# EAGLE design hdmilight-Duo (EAGLE 7.5.0)
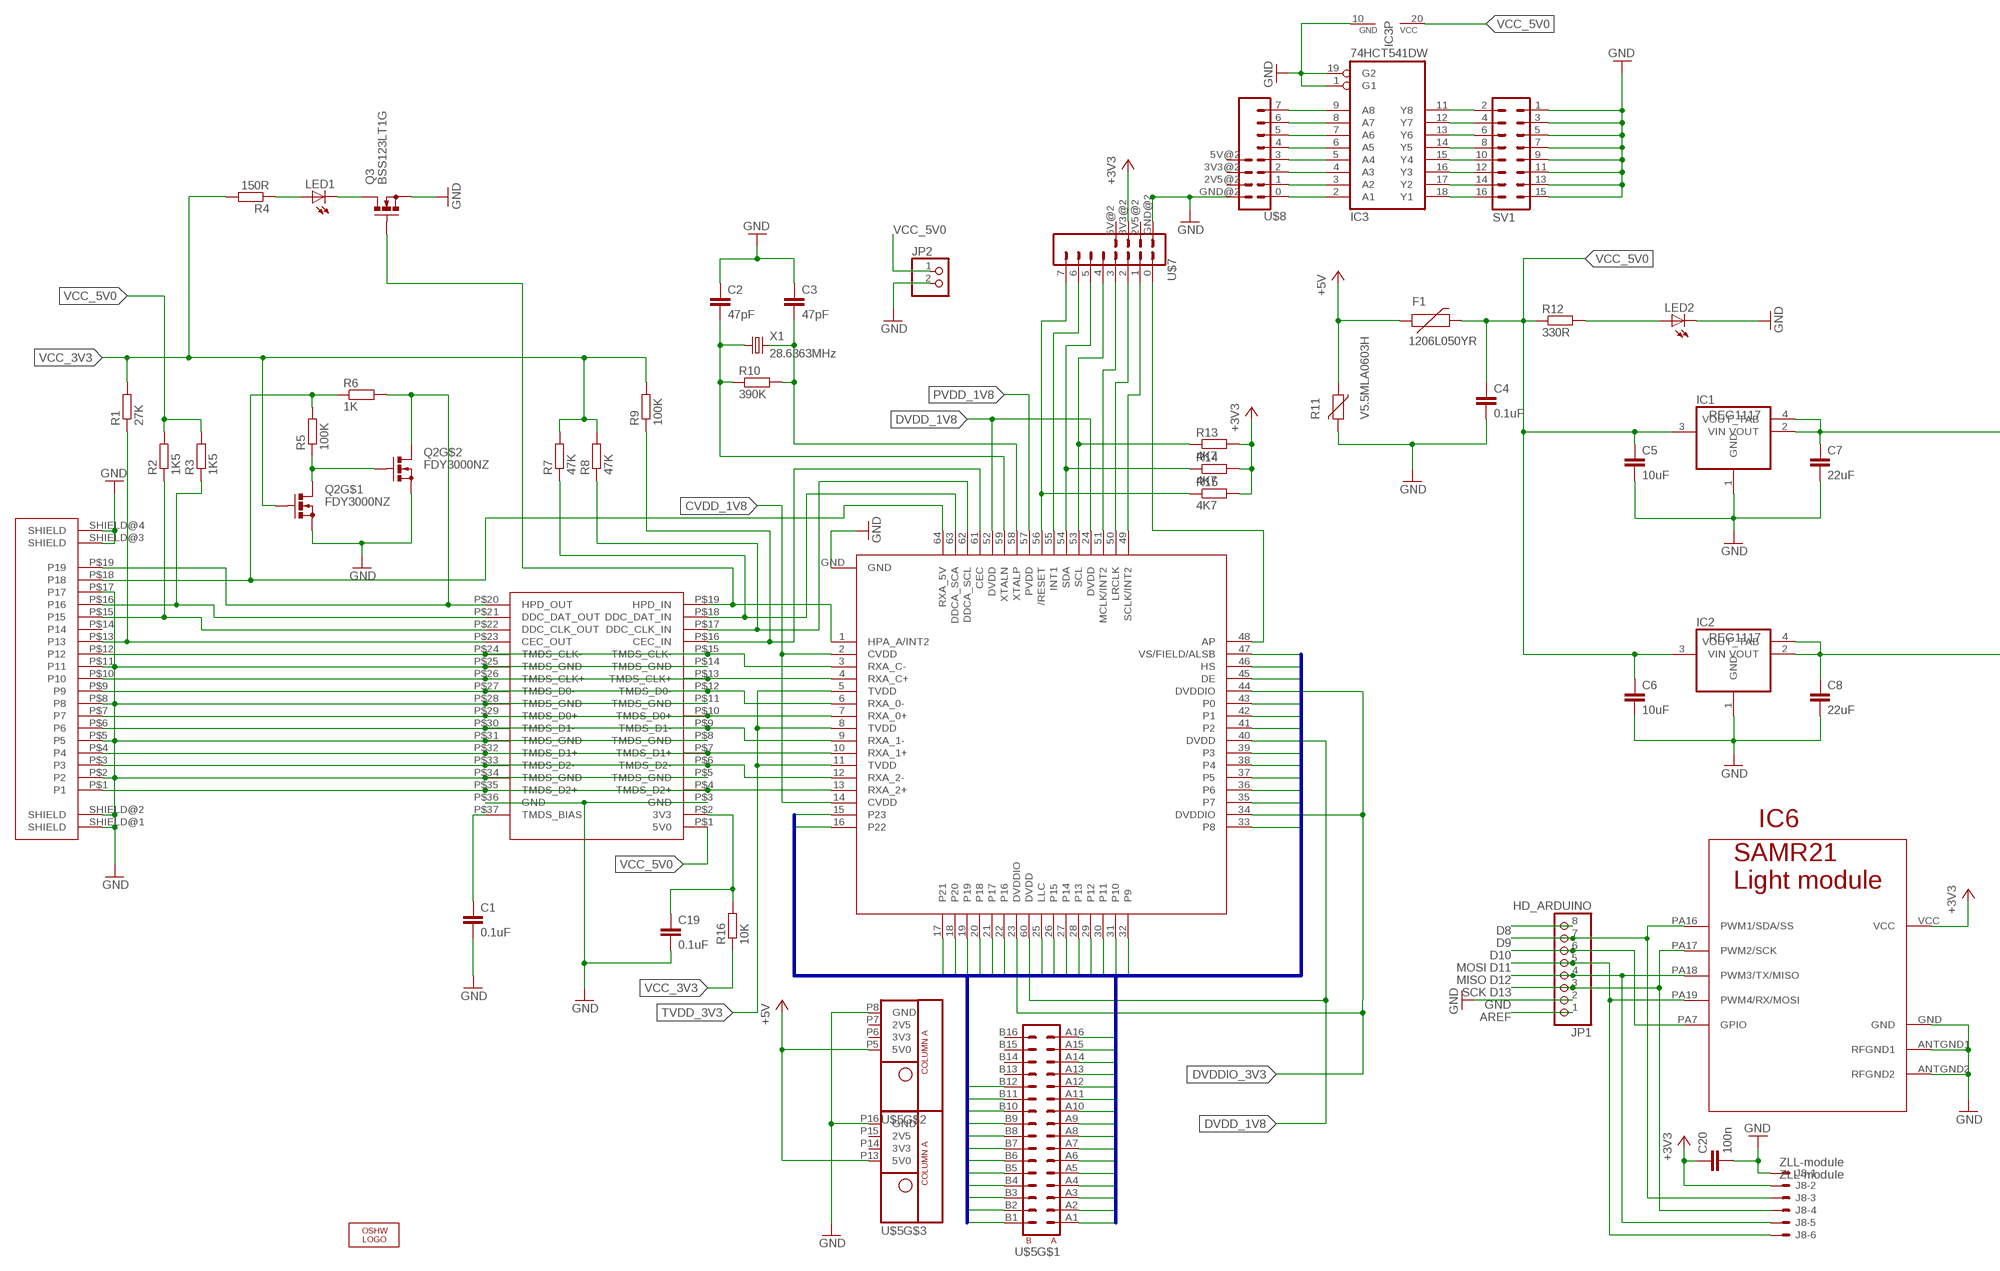
[diagram p0: schematic, sheet 1, part 1 of 2]
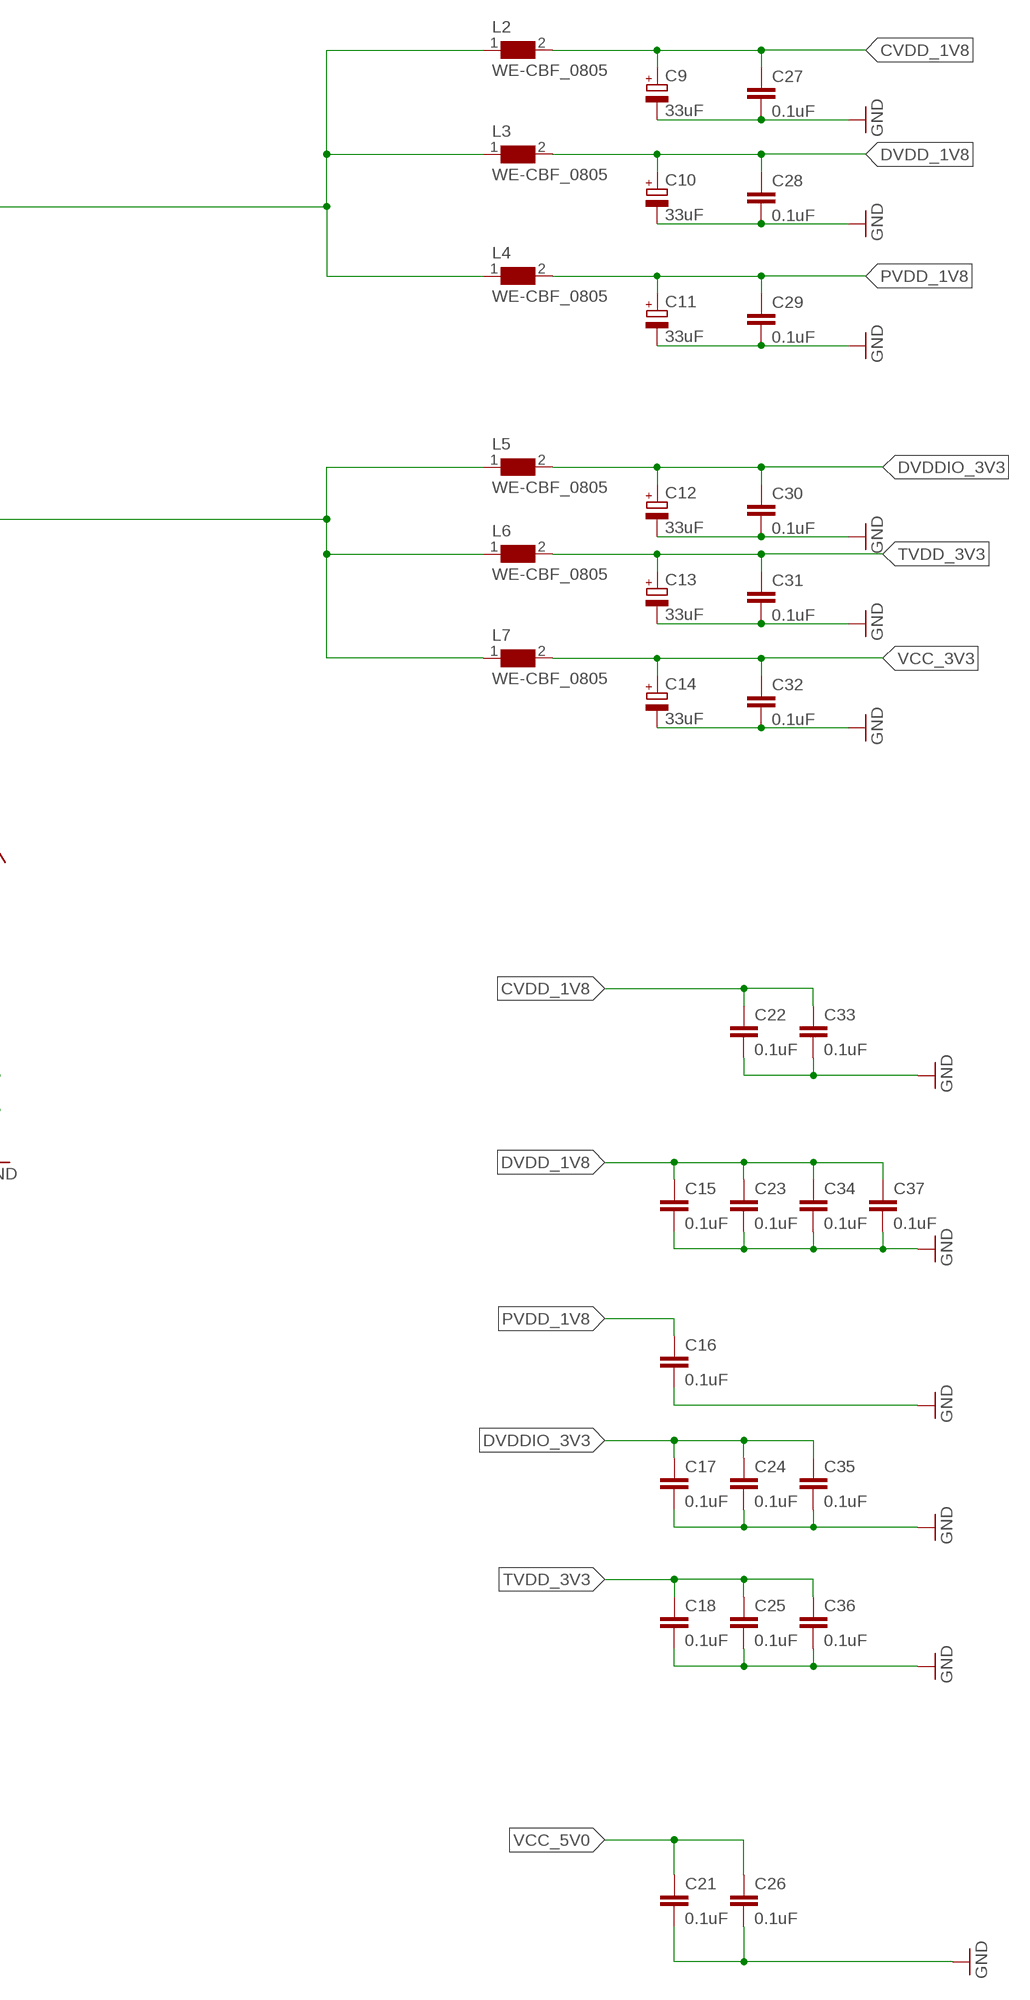
[diagram p1: schematic, sheet 1, part 2 of 2]

## Parts
C1  0.1uF  C-EUC0603  [C0603]
C2  47pF  C-EUC0603  [C0603]
C3  47pF  C-EUC0603  [C0603]
C4  0.1uF  C-EUC0603  [C0603]
C5  10uF  C-EUC1210  [C1210]
C6  10uF  C-EUC1210  [C1210]
C7  22uF  C-EUC1206  [C1206]
C8  22uF  C-EUC1206  [C1206]
C9  33uF  CPOL-EUSMCB  [SMC_B]
C10  33uF  CPOL-EUSMCB  [SMC_B]
C11  33uF  CPOL-EUSMCB  [SMC_B]
C12  33uF  CPOL-EUSMCB  [SMC_B]
C13  33uF  CPOL-EUSMCB  [SMC_B]
C14  33uF  CPOL-EUSMCB  [SMC_B]
C15  0.1uF  C-EUC0402  [C0402]
C16  0.1uF  C-EUC0603  [C0603]
C17  0.1uF  C-EUC0603  [C0603]
C18  0.1uF  C-EUC0402  [C0402]
C19  0.1uF  C-EUC0603  [C0603]
C20  100n  C-EUC0603K  [C0603K]
C21  0.1uF  C-EUC0603  [C0603]
C22  0.1uF  C-EUC0603  [C0603]
C23  0.1uF  C-EUC0402  [C0402]
C24  0.1uF  C-EUC0603  [C0603]
C25  0.1uF  C-EUC0402  [C0402]
C26  0.1uF  C-EUC0603  [C0603]
C27  0.1uF  C-EUC0603  [C0603]
C28  0.1uF  C-EUC0603  [C0603]
C29  0.1uF  C-EUC0603  [C0603]
C30  0.1uF  C-EUC0603  [C0603]
C31  0.1uF  C-EUC0603  [C0603]
C32  0.1uF  C-EUC0603  [C0603]
C33  0.1uF  C-EUC0603  [C0603]
C34  0.1uF  C-EUC0402  [C0402]
C35  0.1uF  C-EUC0402  [C0402]
C36  0.1uF  C-EUC0402  [C0402]
C37  0.1uF  C-EUC0402  [C0402]
F1  1206L050YR  PTCSMD  [PTC-1206]
IC1  REG1117  [SOT223]
IC2  REG1117  [SOT223]
IC3  74HCT541DW  [SO20W]
IC4  ADV7611  [TQFP64-10X10]
IC5  TPD12S520  IP4776CZ38  [TSSOP38]
IC6  SAMR21-MODLL  [SAMR21-LLMOD]
J1  FCI_HDMI_SOCKET_10029449-001RCF  [FCI_HDMI_SOCKET_10029449-001RCF]
J8  ZLL-module  331-06  [331-06]
JP1  HD_ARDUINO  PINHD-1X8/OCT  [1X08/OCT]
JP2  PINHD-1X2/OCT  [1X02/OCT]
L2  WE-CBF_0805  [0805]
L3  WE-CBF_0805  [0805]
L4  WE-CBF_0805  [0805]
L5  WE-CBF_0805  [0805]
L6  WE-CBF_0805  [0805]
L7  WE-CBF_0805  [0805]
LED1  LEDCHIP-LED0805  [CHIP-LED0805]
LED2  LEDCHIP-LED0805  [CHIP-LED0805]
LOGO1  OSHW_LOGO_FILLX0200-NT  [OSHW_FILLX200_NOTEXT]
Q2  FDY3000NZ  [SC89-6]
Q3  BSS123LT1G  [SOT23]
R1  27K  R-EU_R0603  [R0603]
R2  1K5  R-EU_R0603  [R0603]
R3  1K5  R-EU_R0603  [R0603]
R4  150R  R-EU_R0603  [R0603]
R5  100K  R-EU_R0603  [R0603]
R6  1K  R-EU_R0603  [R0603]
R7  47K  R-EU_R0603  [R0603]
R8  47K  R-EU_R0603  [R0603]
R9  100K  R-EU_R0603  [R0603]
R10  390K  R-EU_R0603  [R0603]
R11  V5.5MLA0603H  VARISTORCN0603  [CT/CN0603]
R12  330R  R-EU_R0603  [R0603]
R13  4K7  R-EU_R0603  [R0603]
R14  4K7  R-EU_R0603  [R0603]
R15  4K7  R-EU_R0603  [R0603]
R16  10K  R-EU_R0603  [R0603]
SV1  MA08-2  [MA08-2]
U$5  WING32_HALF  [WING32_HALF_NOHOLES]
U$7  WING8WING8_NOHOLES  [WINGSIDE_8BIT_NOHOLES]
U$8  WING8WING8_NOHOLES  [WINGSIDE_8BIT_NOHOLES]
X1  28.6363MHz  CRYSTALSM49  [SM49]

## Nets
+3V3: C20.1 IC6.VCC J8.3 R13.2 R14.2 R15.2 U$7.3V3@2(3V3)
+5V: F1.1 R11.1 U$5.P5(5V0) U$5.P13(5V0)
AP: IC4.48(AP) U$7.0
AREF: JP1.1
CVDD_1V8: C9.+ C22.1 C27.1 C33.1 IC4.2(CVDD) IC4.14(CVDD) L2.2
D8: JP1.8
D9: IC6.PA16(PWM1/SDA/SS) J8.5 JP1.7
D10: IC6.PA7(GPIO) JP1.6
D11: IC6.PA19(PWM4/RX/MOSI) J8.11 JP1.5
D12: IC6.PA18(PWM3/TX/MISO) J8.9 JP1.4
D13: IC6.PA17(PWM2/SCK) J8.7 JP1.3
DE: IC4.45(DE) U$5.B2
DVDD_1V8: C10.+ C15.1 C23.1 C28.1 C34.1 C37.1 IC4.24(DVDD) IC4.40(DVDD) IC4.52(DVDD) IC4.60(DVDD) L3.2
DVDDIO_3V3: C12.+ C17.1 C24.1 C30.1 C35.1 IC4.23(DVDDIO) IC4.34(DVDDIO) IC4.44(DVDDIO) L5.2
GND: C1.2 C2.1 C3.1 C4.2 C5.2 C6.2 C7.2 C8.2 C9.- C10.- C11.- C12.- C13.- C14.- C15.2 C16.2 C17.2 C18.2 C19.2 C20.2 C21.2 C22.2 C23.2 C24.2 C25.2 C26.2 C27.2 C28.2 C29.2 C30.2 C31.2 C32.2 C33.2 C34.2 C35.2 C36.2 C37.2 IC1.1(GND) IC2.1(GND) IC3.1(G1) IC3.10(GND) IC3.19(G2) IC4.GND IC5.P$3(GND) IC5.P$5(TMDS_GND) IC5.P$8(TMDS_GND) IC5.P$11(TMDS_GND) IC5.P$14(TMDS_GND) IC5.P$25(TMDS_GND) IC5.P$28(TMDS_GND) IC5.P$31(TMDS_GND) IC5.P$34(TMDS_GND) IC5.P$36(GND) IC6.ANTGND1(RFGND1) IC6.ANTGND2(RFGND2) IC6.GND J1.P$2(P2) J1.P$5(P5) J1.P$8(P8) J1.P$11(P11) J1.P$17(P17) J1.SHIELD@1(SHIELD) J1.SHIELD@2(SHIELD) J1.SHIELD@3(SHIELD) J1.SHIELD@4(SHIELD) J8.1 JP1.2 JP2.2 LED2.C Q2.P$1(S) Q2.P$4(S) Q3.2(S) R11.2 SV1.1 SV1.3 SV1.5 SV1.7 SV1.9 SV1.11 SV1.13 SV1.15 U$5.P8(GND) U$5.P16(GND) U$7.GND@2(GND) U$8.GND@2(GND)
HS: IC4.46(HS) U$5.A1
INT1: IC4.55(INT1) U$7.6
LLC: IC4.25(LLC) U$5.A14
LRCLK: IC4.50(LRCLK) U$7.2
MCLK: IC4.51(MCLK/INT2) U$7.3
N$1: IC4.13(RXA_2+) IC5.P$4(TMDS_D2+) IC5.P$35(TMDS_D2+) J1.P$1(P1)
N$2: IC4.12(RXA_2-) IC5.P$6(TMDS_D2-) IC5.P$33(TMDS_D2-) J1.P$3(P3)
N$3: IC4.10(RXA_1+) IC5.P$7(TMDS_D1+) IC5.P$32(TMDS_D1+) J1.P$4(P4)
N$4: IC4.9(RXA_1-) IC5.P$9(TMDS_D1-) IC5.P$30(TMDS_D1-) J1.P$6(P6)
N$5: IC4.7(RXA_0+) IC5.P$10(TMDS_D0+) IC5.P$29(TMDS_D0+) J1.P$7(P7)
N$6: IC4.6(RXA_0-) IC5.P$12(TMDS_D0-) IC5.P$27(TMDS_D0-) J1.P$9(P9)
N$7: IC4.4(RXA_C+) IC5.P$13(TMDS_CLK+) IC5.P$26(TMDS_CLK+) J1.P$10(P10)
N$8: IC4.3(RXA_C-) IC5.P$15(TMDS_CLK-) IC5.P$24(TMDS_CLK-) J1.P$12(P12)
N$9: IC3.9(A8) U$8.7
N$10: IC3.8(A7) U$8.6
N$11: IC3.7(A6) U$8.5
N$12: IC3.6(A5) U$8.4
N$13: IC5.P$23(CEC_OUT) J1.P$13(P13) R1.1
N$14: IC5.P$22(DDC_CLK_OUT) J1.P$15(P15) R2.1
N$15: IC5.P$21(DDC_DAT_OUT) J1.P$16(P16) R3.1
N$16: IC5.P$20(HPD_OUT) J1.P$19(P19) Q2.P$3(D) R6.2
N$17: IC3.5(A4) U$8.3
N$18: IC3.4(A3) U$8.2
N$19: LED2.A R12.2
N$20: IC4.62(DDCA_SCL) IC5.P$17(DDC_CLK_IN) R8.1
N$21: C8.1 IC2.2(VOUT) IC2.4(VOUT_TAB) L5.1 L6.1 L7.1
N$22: C7.1 IC1.2(VOUT) IC1.4(VOUT_TAB) L2.1 L3.1 L4.1
N$23: IC4.63(DDCA_SCA) IC5.P$18(DDC_DAT_IN) R7.1
N$24: IC4.61(CEC) IC5.P$16(CEC_IN) R9.1
N$25: C2.2 IC4.59(XTALN) R10.1 X1.1
N$26: C3.2 IC4.58(XTALP) R10.2 X1.2
N$34: C1.1 IC5.P$37(TMDS_BIAS)
N$35: IC3.3(A2) U$8.1
N$36: IC3.2(A1) U$8.0
N$37: IC3.11(Y8) SV1.2
N$39: IC3.12(Y7) SV1.4
N$40: IC3.13(Y6) SV1.6
N$41: IC3.15(Y4) SV1.10
N$42: IC3.16(Y3) SV1.12
N$44: IC3.17(Y2) SV1.14
N$45: IC3.18(Y1) SV1.16
N$46: IC3.14(Y5) SV1.8
N$47: C19.1 IC5.P$2(3V3) R16.2
N$52: Q2.P$5(G) Q2.P$6(D) R5.1
N$53: IC4.64(RXA_5V) J1.P$18(P18) R5.2 R6.1
N$55: LED1.A R4.1
N$56: LED1.C Q3.3(D)
N$57: IC4.1(HPA_A/INT2) IC5.P$19(HPD_IN) Q3.1(G)
NRESET: IC4.56(/RESET) R15.1 U$7.7
P0: IC4.43(P0) U$5.A2
P1: IC4.42(P1) U$5.B3
P2: IC4.41(P2) U$5.A3
P3: IC4.39(P3) U$5.B4
P4: IC4.38(P4) U$5.A4
P5: IC4.37(P5) U$5.B5
P6: IC4.36(P6) U$5.A5
P7: IC4.35(P7) U$5.B6
P8: IC4.33(P8) U$5.A6
P9: IC4.32(P9) U$5.B7
P10: IC4.31(P10) U$5.A7
P11: IC4.30(P11) U$5.B8
P12: IC4.29(P12) U$5.A8
P13: IC4.28(P13) U$5.B9
P14: IC4.27(P14) U$5.A9
P15: IC4.26(P15) U$5.B10
P16: IC4.22(P16) U$5.A10
P17: IC4.21(P17) U$5.B11
P18: IC4.20(P18) U$5.A11
P19: IC4.19 U$5.B12
P20: IC4.18(P20) U$5.A12
P21: IC4.17(P21) U$5.A13
P22: IC4.16(P22) U$5.A15
P23: IC4.15(P23) U$5.A16
PVDD_1V8: C11.+ C16.1 C29.1 IC4.57(PVDD) L4.2
SCL: IC4.53(SCL) R13.1 U$7.4
SCLK: IC4.49(SCLK/INT2) U$7.1
SDA: IC4.54(SDA) R14.1 U$7.5
TVDD_3V3: C13.+ C18.1 C25.1 C31.1 C36.1 IC4.5(TVDD) IC4.8(TVDD) IC4.11(TVDD) L6.2
VCC_3V3: C14.+ C32.1 L7.2 Q2.P$2(G) R1.2 R4.2 R7.2 R8.2 R9.2 R16.1
VCC_5V0: C4.1 C5.1 C6.1 C21.1 C26.1 F1.2 IC1.3(VIN) IC2.3(VIN) IC3.20(VCC) IC5.P$1(5V0) JP2.1 R2.2 R3.2 R12.1
VS: IC4.47(VS/FIELD/ALSB) U$5.B1
Unconnected: J1.P$14(P14) U$5.B13 U$5.B14 U$5.B15 U$5.B16 U$5.P6(3V3) U$5.P7(2V5) U$5.P14(3V3) U$5.P15(2V5) U$7.2V5@2(2V5) U$7.5V@2(5V) U$8.2V5@2(2V5) U$8.3V3@2(3V3) U$8.5V@2(5V)

## Buses
P[0..23],LLC,DE,HS,VS

## Notes on the sheet
- MOSI
- MISO
- SCK

## Library data of the parts
C1-C8 C15-C19 C21-C37 = resistor:C-EU: CAPACITOR, European symbol
C9-C14 = resistor:CPOL-EU: POLARIZED CAPACITOR, European symbol
C20 = rcl:C-EU: CAPACITOR, European symbol
F1 = SparkFun:PTC: Resettable Fuse PTC Resettable Fuse. Spark Fun Electronics SKU : COM-08357
IC1 IC2 = burr-brown:REG1117: 800mA and 1A Low Dropout (LDO) Positive Regulator 1.8V, 2.5V, 2.85V, 3.3V, 5V, and Adj; MPN: REG1117; OC_FARNELL: 1097566; OC_NEWARK: 14P6981
IC3 = 74xx-eu:74*541: Octal BUFFER and LINE DRIVER, 3-state
IC4 = __SR:ADV7611
IC5 = __SR:IP4776CZ38
IC6 = Papilio:SAMR21-MODLL
J1 = __SR:FCI_HDMI_SOCKET_10029449-001RCF
J8 = con-garry:331-06: 6 Pin - 2mm Dual Row Source: www.mpe-connector.de / garry_shortform_2012.pdf
JP1 = pinhead_v2:PINHD-1X8: PIN HEADER
JP2 = pinhead_v2:PINHD-1X2: PIN HEADER
L2-L7 = EagleLibrary_Wuerth_Elektronik_eiSos_Version_6:WE-CBF: SMD EMI Suppression Ferrite Beads WE-CBF - Excellent anti-EMI properties - Low DC-restistance - Impedances till 3000 ohms - Rated current up to 6 A -- Reliable Ni-Sn electrodes -- Perfect as data lined filter and for uncoupling of distribution voltage
LED1 LED2 = led:LED: LED OSRAM: - CHIPLED LG R971, LG N971, LY N971, LG Q971, LY Q971, LO R971, LY R971 LH N974, LH R974 LS Q976, LO Q976, LY Q976 LO Q996 - Hyper CHIPLED LW Q18S LB Q993, LB Q99A, LB R99A - SideLED LS A670, LO A670, LY A670, LG A670, LP A670 LB A673, LV A673, LT A673, LW A673 LH A674 LY A675 LS A676, LA A676, LO A676, LY A676, LW A676 LS A679, LY A679, LG A679 - Hyper Micro SIDELED® LS Y876, LA Y876, LO Y876, LY Y876 LT Y87S - SmartLED LW L88C, LW L88S LB L89C, LB L89S, LG L890 LS L89K, LO L89K, LY L89K LS L896, LA L896, LO L896, LY L896 - TOPLED LS T670, LO T670, LY T670, LG T670, LP T670 LSG T670, LSP T670, LSY T670, LOP T670, LYG T670 LG T671, LOG T671, LSG T671 LB T673, LV T673, LT T673, LW T673 LH T674 LS T676, LA T676, LO T676, LY T676, LB T676, LH T676, LSB T676, LW T676 LB T67C, LV T67C, LT T67C, LS T67K, LO T67K, LY T67K, LW E67C LS E67B, LA E67B, LO E67B, LY E67B, LB E67C, LV E67C, LT E67C LW T67C LS T679, LY T679, LG T679 LS T770, LO T770, LY T770, LG T770, LP T770 LB T773, LV T773, LT T773, LW T773 LH T774 LS E675, LA E675, LY E675, LS T675 LS T776, LA T776, LO T776, LY T776, LB T776 LHGB T686 LT T68C, LB T68C - Hyper Mini TOPLED® LB M676 - Mini TOPLED Santana® LG M470 LS M47K, LO M47K, LY M47K Source: http://www.osram.convergy.de LUXEON: - LUMILED® LXK2-PW12-R00, LXK2-PW12-S00, LXK2-PW14-U00, LXK2-PW14-V00 LXK2-PM12-R00, LXK2-PM12-S00, LXK2-PM14-U00 LXK2-PE12-Q00, LXK2-PE12-R00, LXK2-PE12-S00, LXK2-PE14-T00, LXK2-PE14-U00 LXK2-PB12-K00, LXK2-PB12-L00, LXK2-PB12-M00, LXK2-PB14-N00, LXK2-PB14-P00, LXK2-PB14-Q00 LXK2-PR12-L00, LXK2-PR12-M00, LXK2-PR14-Q00, LXK2-PR14-R00 LXK2-PD12-Q00, LXK2-PD12-R00, LXK2-PD12-S00 LXK2-PH12-R00, LXK2-PH12-S00 LXK2-PL12-P00, LXK2-PL12-Q00, LXK2-PL12-R00 Source: www.luxeon.com KINGBRIGHT: KA-3528ASYC Source: www.kingbright.com
LOGO1 = ohw-logo:OSHW_LOGO_FILL
Q2 = __SR:FDY3000NZ
Q3 = __SR:BSS123LT1G
R1-R10 R12-R16 = resistor:R-EU_: RESISTOR, European symbol
R11 = varistor:VARISTOR: VARISTOR
SV1 = con-lstb:MA08-2: PIN HEADER; OC_FARNELL: unknown; OC_NEWARK: unknown
U$5 = Papilio:WING32_HALF
U$7 U$8 = Papilio:WING8
X1 = crystal:CRYSTAL: CRYSTAL; OC_FARNELL: unknown; OC_NEWARK: unknown

## Board
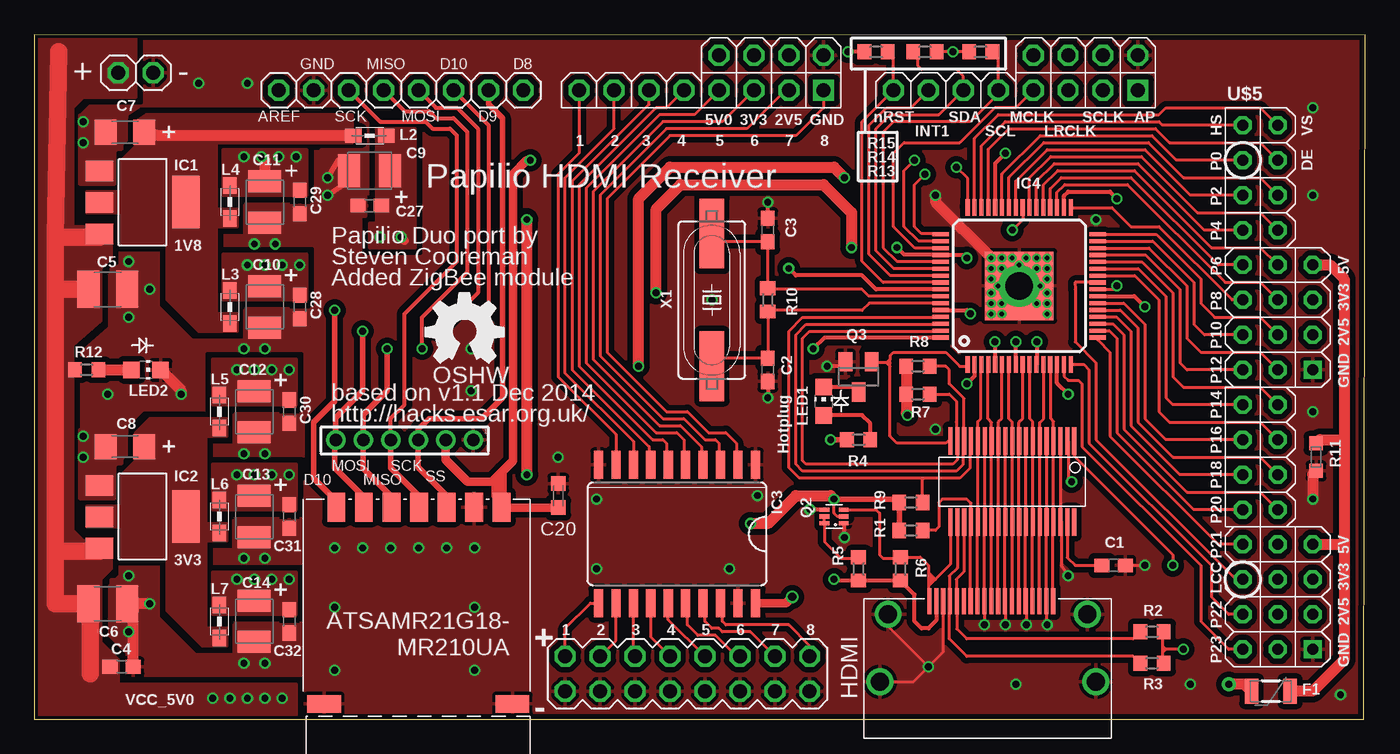
[diagram p2: board, top side]
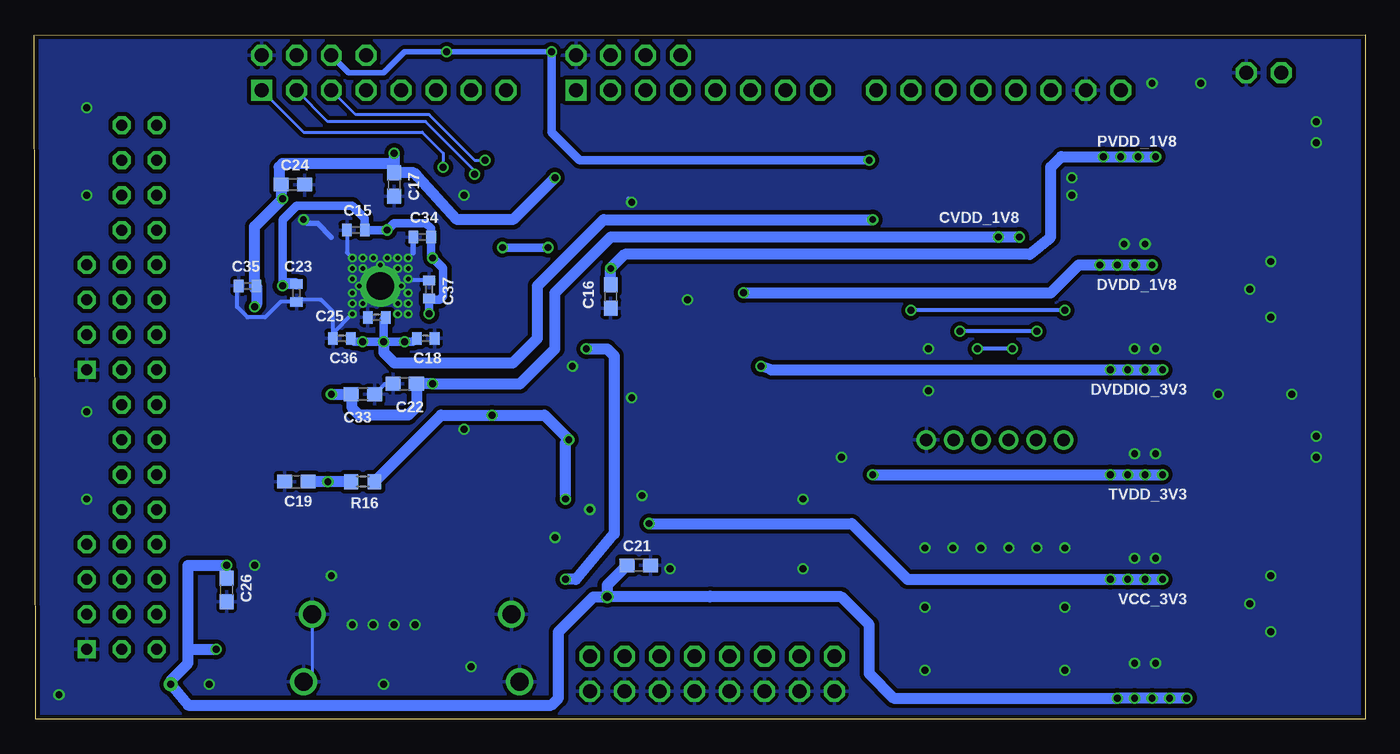
[diagram p3: board, bottom side, seen from below]

Size 96.78 x 49.77 mm. Coordinates in mm from the lower left corner, seen from the top.
Outline: 0,0 96.7,0 96.78,49.71 0,49.77 0,0
Copper layers (1*16): Top 0.035mm / dielectric 1.5mm / Bottom 0.035mm
Design rules "SeeedStudio_2layer_DRU_no_angle_20140221": minimum track width 6mil, minimum drill 12mil, track to track 6mil, track to pad 6mil, pad to pad 6mil, via to via 6mil, smd to smd 0mil, copper to edge 10mil, drill to drill 10mil, minimum pad ring 10mil, minimum via ring 6mil, stop-mask expansion 2mil, vias tented up to drill 100mil, thermal gap 10mil

### Footprints (pad centres in the part's own frame; a part is rotated, then mirrored left to right if it is on the bottom)
C0603 = smd 1.1 x 1: 1 -0.85,0; 2 0.85,0
C1210 = smd 1.6 x 2.7: 1 -1.4,0; 2 1.4,0
C1206 = smd 1.6 x 1.8: 1 -1.4,0; 2 1.4,0
SMC_B = smd 1.6 x 2.4: + -1.5,0; - 1.5,0
C0402 = smd 0.7 x 0.9: 1 -0.65,0; 2 0.65,0
C0603K = smd 1.05 x 1.08: 1 -0.875,0; 2 0.875,0
PTC-1206 = smd 1 x 1.8: 1 -1.4,0; 2 1.4,0
SOT223 = smd 1.499 x 2.007: 1 -2.261,-3.15; 2 0.025,-3.15; 3 2.311,-3.15 | smd 3.81 x 2.007: 4 0,3.15
SO20W = smd 0.66 x 2.032: 1 -5.715,-5.029; 2 -4.445,-5.029; 3 -3.175,-5.029; 4 -1.905,-5.029; 5 -0.635,-5.029; 6 0.635,-5.029; 7 1.905,-5.029; 8 3.175,-5.029; 9 4.445,-5.029; 10 5.715,-5.029; 11 5.715,5.029; 12 4.445,5.029; 13 3.175,5.029; 14 1.905,5.029; 15 0.635,5.029; 16 -0.635,5.029; 17 -1.905,5.029; 18 -3.175,5.029; 19 -4.445,5.029; 20 -5.715,5.029
TQFP64-10X10 = smd 1.2 x 0.3: 1 -5.7,3.75; 2 -5.7,3.25; 3 -5.7,2.75; 4 -5.7,2.25; 5 -5.7,1.75; 6 -5.7,1.25; 7 -5.7,0.75; 8 -5.7,0.25; 9 -5.7,-0.25; 10 -5.7,-0.75; 11 -5.7,-1.25; 12 -5.7,-1.75; 13 -5.7,-2.25; 14 -5.7,-2.75; 15 -5.7,-3.25; 16 -5.7,-3.75; 33 5.7,-3.75; 34 5.7,-3.25; 35 5.7,-2.75; 36 5.7,-2.25; 37 5.7,-1.75; 38 5.7,-1.25; 39 5.7,-0.75; 40 5.7,-0.25; 41 5.7,0.25; 42 5.7,0.75; 43 5.7,1.25; 44 5.7,1.75; 45 5.7,2.25; 46 5.7,2.75; 47 5.7,3.25; 48 5.7,3.75 | smd 0.3 x 1.2: 17 -3.75,-5.7; 18 -3.25,-5.7; 19 -2.75,-5.7; 20 -2.25,-5.7; 21 -1.75,-5.7; 22 -1.25,-5.7; 23 -0.75,-5.7; 24 -0.25,-5.7; 25 0.25,-5.7; 26 0.75,-5.7; 27 1.25,-5.7; 28 1.75,-5.7; 29 2.25,-5.7; 30 2.75,-5.7; 31 3.25,-5.7; 32 3.75,-5.7; 49 3.75,5.7; 50 3.25,5.7; 51 2.75,5.7; 52 2.25,5.7; 53 1.75,5.7; 54 1.25,5.7; 55 0.75,5.7; 56 0.25,5.7; 57 -0.25,5.7; 58 -0.75,5.7; 59 -1.25,5.7; 60 -1.75,5.7; 61 -2.25,5.7; 62 -2.75,5.7; 63 -3.25,5.7; 64 -3.75,5.7 | smd 5 x 5: GND 0,0
TSSOP38 = smd 0.3 x 2: P$1 -4.5,-2.95; P$2 -4,-2.95; P$3 -3.5,-2.95; P$4 -3,-2.95; P$5 -2.5,-2.95; P$6 -2,-2.95; P$7 -1.5,-2.95; P$8 -1,-2.95; P$9 -0.5,-2.95; P$10 0,-2.95; P$11 0.5,-2.95; P$12 1,-2.95; P$13 1.5,-2.95; P$14 2,-2.95; P$15 2.5,-2.95; P$16 3,-2.95; P$17 3.5,-2.95; P$18 4,-2.95; P$19 4.5,-2.95; P$20 4.5,2.95; P$21 4,2.95; P$22 3.5,2.95; P$23 3,2.95; P$24 2.5,2.95; P$25 2,2.95; P$26 1.5,2.95; P$27 1,2.95; P$28 0.5,2.95; P$29 0,2.95; P$30 -0.5,2.95; P$31 -1,2.95; P$32 -1.5,2.95; P$33 -2,2.95; P$34 -2.5,2.95; P$35 -3,2.95; P$36 -3.5,2.95; P$37 -4,2.95; P$38 -4.5,2.95
SAMR21-LLMOD = smd 2.45 x 1.3: ANTGND1 1.3,14.9; ANTGND2 15,14.9 | smd 1.3 x 2.1: GND 4.1,0.6; PA7 14.1,0.6; PA16 6.1,0.6; PA17 8.1,0.6; PA18 10.1,0.6; PA19 12.1,0.6; VCC 2.1,0.6
FCI_HDMI_SOCKET_10029449-001RCF = smd 0.3 x 1.9: P$1 4.75,0.95; P$2 4.25,0.95; P$3 3.75,0.95; P$4 3.25,0.95; P$5 2.75,0.95; P$6 2.25,0.95; P$7 1.75,0.95; P$8 1.25,0.95; P$9 0.75,0.95; P$10 0.25,0.95; P$11 -0.25,0.95; P$12 -0.75,0.95; P$13 -1.25,0.95; P$14 -1.75,0.95; P$15 -2.25,0.95; P$16 -2.75,0.95; P$17 -3.25,0.95; P$18 -3.75,0.95; P$19 -4.25,0.95 | drill 1.3: SHIELD@1 -7.25,0; SHIELD@2 -7.85,-4.9; SHIELD@3 7.25,0; SHIELD@4 7.85,-4.9
331-06 = drill 0.9 pad 1.27: 1 -5,-1; 3 -3,-1; 5 -1,-1; 7 1,-1; 9 3,-1; 11 5,-1
1X08/OCT = drill 1.016 octagon: 1 -8.89,0; 2 -6.35,0; 3 -3.81,0; 4 -1.27,0; 5 1.27,0; 6 3.81,0; 7 6.35,0; 8 8.89,0
1X02/OCT = drill 1.016 octagon: 1 -1.27,0; 2 1.27,0
0805 = smd 1.2 x 1: 1 -1.2,0; 2 1.2,0
CHIP-LED0805 = smd 1.2 x 1.2: A 0,-1.05; C 0,1.05
SC89-6 = smd 0.3 x 0.7: P$1 -0.5,-0.7; P$2 0,-0.7; P$3 0.5,-0.7; P$4 0.5,0.7; P$5 0,0.7; P$6 -0.5,0.7
SOT23 = smd 1 x 1.4: 1 -0.95,-1.1; 2 0.95,-1.1; 3 0,1.1
R0603 = smd 1 x 1.1: 1 -0.85,0; 2 0.85,0
CT/CN0603 = smd 1 x 1: 1 -1,0; 2 1,0
MA08-2 = drill 1.016 octagon: 1 -8.89,-1.27; 2 -8.89,1.27; 3 -6.35,-1.27; 4 -6.35,1.27; 5 -3.81,-1.27; 6 -3.81,1.27; 7 -1.27,-1.27; 8 -1.27,1.27; 9 1.27,-1.27; 10 1.27,1.27; 11 3.81,-1.27; 12 3.81,1.27; 13 6.35,-1.27; 14 6.35,1.27; 15 8.89,-1.27; 16 8.89,1.27
WING32_HALF_NOHOLES = drill 0.8 octagon: A1 -1.27,19.05; A2 -1.27,16.51; A3 -1.27,13.97; A4 -1.27,11.43; A5 -1.27,8.89; A6 -1.27,6.35; A7 -1.27,3.81; A8 -1.27,1.27; A9 -1.27,-1.27; A10 -1.27,-3.81; A11 -1.27,-6.35; A12 -1.27,-8.89; A13 -1.27,-11.43; A14 -1.27,-13.97; A15 -1.27,-16.51; A16 -1.27,-19.05; B1 1.27,19.05; B2 1.27,16.51; B3 1.27,13.97; B4 1.27,11.43; B5 1.27,8.89; B6 1.27,6.35; B7 1.27,3.81; B8 1.27,1.27; B9 1.27,-1.27; B10 1.27,-3.81; B11 1.27,-6.35; B12 1.27,-8.89; B13 1.27,-11.43; B14 1.27,-13.97; B15 1.27,-16.51; B16 1.27,-19.05; P5 3.81,8.89; P6 3.81,6.35; P7 3.81,3.81; P13 3.81,-11.43; P14 3.81,-13.97; P15 3.81,-16.51 | drill 0.8 square: P8 3.81,1.27; P16 3.81,-19.05
WINGSIDE_8BIT_NOHOLES = drill 1.016 square: 0 19.05,1.27 | drill 1.016 octagon: 1 16.51,1.27; 2 13.97,1.27; 2V5@2 16.51,3.81; 3 11.43,1.27; 3V3@2 13.97,3.81; 4 8.89,1.27; 5 6.35,1.27; 5V@2 11.43,3.81; 6 3.81,1.27; 7 1.27,1.27; GND@2 19.05,3.81
SM49 = smd 5.08 x 1.778: 1 -4.826,0; 2 4.826,0

### Placement (x,y rotation side)
C1  78.49,11.18 0 top
C2  53.34,25.4 90 top
C3  53.34,35.56 270 top
C4  6.35,3.81 0 top
C5  5.33,31.24 0 top
C6  5.33,8.38 0 top
C7  6.6,42.67 180 top
C8  6.6,19.81 180 top
C9  24.38,39.88 180 top
C10  16.76,29.97 270 top
C11  16.76,37.59 270 top
C12  16,22.35 270 top
C13  16,14.73 270 top
C14  16,7.11 270 top
C15  73.41,35.56 180 bottom
C16  54.86,30.73 270 bottom
C17  70.61,38.86 270 bottom
C18  68.33,27.69 0 bottom
C19  77.72,17.27 180 bottom
C20  38.1,16.26 90 top
C21  52.83,11.18 0 bottom
C22  69.85,24.38 180 bottom
C23  77.72,30.99 270 bottom
C24  77.98,38.86 0 bottom
C25  71.88,29.21 180 bottom
C26  82.8,9.4 270 bottom
C27  24.38,37.34 180 top
C28  19.3,29.97 270 top
C29  19.3,37.59 270 top
C30  18.54,22.35 270 top
C31  18.54,14.73 270 top
C32  18.54,7.11 270 top
C33  72.9,23.62 0 bottom
C34  68.58,35.05 180 bottom
C35  81.28,31.5 180 bottom
C36  74.42,27.69 180 bottom
C37  68.07,31.24 90 bottom
F1  89.92,2.03 180 top
IC1  7.87,37.59 270 top
IC2  7.87,14.73 270 top
IC3  46.74,13.46 180 top
IC4  71.63,31.5 90 top
IC5  71.12,17.27 180 top
IC6  36.07,16 180 top
J1  69.34,7.62 0 top
J8  26.92,19.3 180 top
JP1  26.67,45.72 0 top
JP2  7.37,46.99 0 top
L2  24.38,42.42 0 top
L3  14.22,29.97 90 top
L4  14.22,37.59 90 top
L5  13.46,22.35 90 top
L6  13.46,14.73 90 top
L7  13.46,7.11 90 top
LED1  57.4,23.11 0 top
LED2  8.13,25.4 270 top
LOGO1  28.45,25.91 0 top
Q2  58.17,14.73 90 top
Q3  59.94,24.89 180 top
R1  63.75,13.72 180 top
R2  81.28,6.35 0 top
R3  81.28,4.06 0 top
R4  59.94,20.32 180 top
R5  59.94,10.92 270 top
R6  62.99,10.92 90 top
R7  64.26,23.62 180 top
R8  64.26,25.65 180 top
R9  63.75,15.75 180 top
R10  53.34,30.48 90 top
R11  93.22,19.05 270 top
R12  3.81,25.4 0 top
R13  68.83,48.51 180 top
R14  64.77,48.51 0 top
R15  61.21,48.51 180 top
R16  72.9,17.27 180 bottom
SV1  47.5,3.3 0 top
U$5  89.15,24.13 0 top
U$7  61.21,44.45 0 top
U$8  38.35,44.45 0 top
X1  49.28,30.48 90 top

### Tracks (layer width: path | path; a pad name or v marks a point on that pad's centre or on a via)
+3V3  (via drill 0.5)
  Top 0.203: R13.2 v66.8,48.51 R14.2
  Top 0.305: R15.2 v59.18,48.51
  Top 0.61: v36.07,40.64 35.81,40.64 34.8,39.62 34.8,18.8 34.04,18.03 | 34.04,18.03 34.04,17.27 | 34.04,17.27 34.04,15.47 IC6.VCC 33.99,15.38 C20.1 | J8.3 29.92,18.84 31.5,17.27 33.27,17.27 | 33.27,17.27 33.53,17.27 | 33.53,17.27 34.04,17.27 | 33.53,17.27 33.53,16.26 33.78,16 | 33.27,17.27 34.04,18.03
  Bottom 0.406: U$7.3V3@2 73.91,46.99 71.37,46.99 69.85,48.51 v66.8,48.51 v59.18,48.51
  Bottom 0.61: v59.18,48.51 59.18,42.67 57.15,40.64 v36.07,40.64
+5V
  Top 0.813: U$5.P5 94.23,33.02 95.25,32 95.25,20.32 | 95.25,20.32 95.25,12.7 | 95.25,12.7 95.25,4.32 92.96,2.03 F1.1 | R11.1 93.49,20.32 95.25,20.32 | U$5.P13 95.25,12.7
AP  (via drill 0.5)
  Top 0.203: 67.82,37.26 IC4.48 67.88,39.31 v67.06,40.13
  Bottom 0.203: U$7.0 77.22,42.67 68.58,42.67 67.06,41.15 v67.06,40.13
CVDD_1V8  (via drill 0.5)
  Top 0.305: v75.18,23.62 74.38,24.43 IC4.14 | IC4.2 68.38,24.94 v67.82,24.38
  Top 0.61: 26.92,34.8 v26.67,35.05
  Bottom 0.61: 73.66,23.53 C33.1
  Bottom 0.813: v75.18,23.62 C33.1 | 73.66,23.53 73.66,22.61 73.15,22.1 69.6,22.1 69,22.69 C22.1 v67.82,24.38 61.47,24.38 58.93,26.92 58.93,30.99 54.86,35.05 v25.15,35.05
  pour Top (no thermals): 24.89,42.93 24.89,36.07 24.38,36.07 24.38,34.29 27.69,34.29 27.69,42.93
D9
  Top 0.406: JP1.7 33.02,44.7 34.04,43.69 34.04,23.37 32.51,21.84 28.7,21.84 27.92,21.07 J8.5 27.92,18.3 29.97,16.26 IC6.PA16
D10  (via drill 0.5)
  Top 0.203: IC6.PA7 21.84,15.53
  Top 0.305: JP1.6 33.02,43.18 v33.02,29.72
  Top 0.406: 21.84,15.53 21.84,16 20.32,17.53 20.32,21.59 21.84,23.11 v21.84,29.72
  Bottom 0.305: v21.84,29.72 v33.02,29.72
D11  (via drill 0.5)
  Top 0.203: IC6.PA19 23.88,15.49
  Top 0.305: JP1.5 29.21,44.45 30.73,44.45 32.26,42.93 32.26,30.99 v29.46,28.19
  Top 0.406: 23.88,15.49 23.88,16.26 21.84,18.29 21.84,19.72 J8.11 21.92,21.92 23.88,23.88 v23.88,28.19
  Bottom 0.203: v29.46,28.19 29.21,28.19
  Bottom 0.305: v23.88,28.19 29.21,28.19
D12  (via drill 0.5)
  Top 0.203: IC6.PA18 25.65,15.72
  Top 0.305: JP1.4 26.92,44.2 28.7,44.2 29.21,43.69 30.48,43.69 31.5,42.67 31.5,32.51 28.19,29.21 v28.19,26.92
  Top 0.406: IC6.PA18 25.91,15.46 25.91,16.26 23.92,18.24 J8.9 23.92,22.15 25.65,23.88 v25.65,26.92
  Bottom 0.305: v25.65,26.92 v28.19,26.92
D13
  Top 0.305: JP1.3 25.15,43.43 28.45,43.43 28.96,42.93 30.23,42.93 30.73,42.42 30.73,33.27 26.92,29.46 26.92,25.91 26.92,25.65 26.92,22.86 25.92,21.86 J8.7
  Top 0.406: J8.7 25.92,18.27 27.94,16.26 27.94,15.43 IC6.PA17
DE
  Top 0.203: IC4.45 69.38,41.44 70.87,42.93 81.53,42.93 82.55,41.91 89.15,41.91 U$5.B2
DVDD_1V8  (via drill 0.5)
  Top 0.203: IC4.24 78.49,31.25 v78.74,31.5 | IC4.40 71.88,36.32 v71.12,35.56
  Top 0.305: v67.82,33.53 67.6,33.75 IC4.52 65.89,33.78 63.25,33.78 v62.74,34.29 | IC4.60 67.79,29.75 v68.07,29.46
  Top 0.813: v45.21,30.99 45.21,37.08 46.99,38.86 57.4,38.86 59.44,36.83 v59.44,34.29
  Bottom 0.305: 67.96,30.48 C37.1
  Bottom 0.61: v68.07,29.46 C37.1 | 67.96,30.48 67.31,30.48 67.06,30.73 67.06,32.77 v67.82,33.53 67.93,33.64 C34.1 67.93,35.67 68.33,36.07 70.61,36.07 v71.12,35.56 C15.1 72.76,36.43 73.66,37.34 77.72,37.34 78.74,36.32 v78.74,31.5 | v59.44,34.29 v62.74,34.29
  Bottom 0.813: C23.1 78.6,31.64 v78.74,31.5 | v15.49,33.02 20.83,33.02 22.86,30.99 v45.21,30.99
  other vias: 16.76,33.02 18.03,33.02 19.3,33.02
  pour Top (no thermals): 13.72,30.48 19.81,30.48 19.81,33.78 13.72,33.78
DVDDIO_3V3  (via drill 0.5)
  Top 0.203: 74.93,37.14 IC4.34
  Top 0.305: IC4.34 74.88,38.05 75.18,38.35 78.23,38.35 v78.74,37.85 | IC4.44 69.88,40.41 v70.61,41.15 | IC4.23 80,30.75 v80.77,29.97
  Top 0.813: v43.94,25.65 43.94,37.85 46.23,40.13 58.17,40.13 v58.93,39.37
  Bottom 0.305: 80.77,31.35 C35.1
  Bottom 0.61: 78.99,39.03 C24.1
  Bottom 0.813: C24.1 78.83,37.93 v78.74,37.85 80.77,35.81 80.77,31.35 | C35.1 80.63,30.11 v80.77,29.97 | v43.94,25.65 43.18,25.4 v14.73,25.4 | 78.99,39.03 78.99,40.13 78.74,40.39 70.61,40.39 | v58.93,39.37 61.98,36.32 66.04,36.32 68.92,39.46 69.18,39.71 C17.1 70.61,40.39 | v70.61,41.15 70.61,40.39
  other vias: 16,25.4 17.27,25.4 18.54,25.4
  pour Top (no thermals): 12.95,22.86 19.05,22.86 19.05,26.16 12.95,26.16
GND  (via drill 0.33, 0.5, 2)
  Top 0.203: Q2.P$4 | IC5.P$5 IC5.P$34 73.59,14.29 J1.P$2 73.59,6.93 v73.66,6.86 | IC5.P$8 IC5.P$31 72.09,14.29 J1.P$5 72.14,8.53 v72.14,6.86 | IC5.P$11 IC5.P$28 70.59,14.29 J1.P$8 70.61,8.55 v70.61,6.86 | IC5.P$14 IC5.P$25 69.09,14.29 J1.P$11 v69.09,6.86 | J1.P$17 66.09,4.88 v65.02,3.81 | J1.SHIELD@1 62.09,6.74 v65.02,3.81 | J1.SHIELD@2 63.93,2.72 v65.02,3.81 | IC5.P$36 74.68,14.38 74.68,13.72 | C1.2 v80.77,11.18 | 74.68,13.72 74.68,11.18 v75.18,10.41 | IC5.P$3 74.62,13.77 74.68,13.72
  Top 0.305: v58.93,13.21 58.93,14.17 Q2.P$1 | Q3.2 58.66,25.65 v57.66,25.65 | Q2.P$4 v56.4,15.23 v56.39,15.24 | C2.1 v53.34,23.37 | C3.1 v53.34,37.59
  Top 0.406: v21.34,38.1 22.86,39.12 | v21.34,39.37 22.1,40.64
  Top 0.813: C4.2 7.2,7.92 C6.2 v8.38,8.38 | v65.53,38.1 65.53,37.59 v69.6,33.53 | R11.2 92.96,17.8 v92.96,16 | LED2.C 10.67,23.91 v10.67,23.62
  Bottom 0.203: 69.23,33.89 v69.6,33.53 | C22.2 71.29,24.38 | J1.SHIELD@3 76.59,3.32 J1.SHIELD@4 | v69.09,6.86 69.09,6.6
  Bottom 0.305: C15.2 74.06,33.92 v73.66,33.53 | 71.29,24.38 C33.2 | C37.2 69.48,31.89 v69.6,32 | v73.66,29.46 75.07,28.05 C36.2 75.07,29.61 75.95,30.48 77.58,30.48 C23.2 78.88,30.34 80.01,29.21 81.28,29.21 82.04,29.97 82.04,31.38 C35.2 | v57.66,25.65 57.4,25.65 | v56.39,15.24 56.39,14.99 | v53.34,23.37 53.34,23.11 | v53.34,37.59 53.59,37.85
  Bottom 0.406: C34.2 69.23,33.89 | 75.18,35.05 76.2,36.07 76.96,36.07 v77.22,36.32
  other vias: 71.63,31.5 70.36,33.53 71.12,33.53 72.14,33.53 72.9,33.53 69.6,32.77 70.36,32.77 72.9,32.77 73.66,32.77 73.66,32 73.66,30.99 72.9,30.23 73.66,30.23 69.6,30.99 69.6,30.23 70.36,30.23 69.6,29.46 70.36,29.46 70.1,31.5 73.15,31.5 71.63,33.02 6.86,6.35 6.86,10.41 6.86,29.21 8.38,31.24 6.86,33.27 15.24,4.06 16.76,4.06 15.24,11.68 16.76,11.68 15.24,19.3 16.76,19.3 15.24,26.92 16.76,26.92 16,34.54 17.53,34.54 3.56,19.05 3.56,20.57 3.56,41.91 3.56,43.43 40.89,16 52.58,16.26 5.33,23.62 11.94,46.23 15.49,46.23 92.96,44.45 92.96,38.1 71.37,2.54 84.07,2.54 92.96,22.35 50.55,10.92 49.28,30.48 95,1.78 65.53,21.08 40.89,10.92 21.84,12.45 23.88,12.45 25.91,12.45 27.94,12.45 29.97,12.45 32,12.45 21.84,8.13 21.84,3.56 32,3.56 32,8.13 31.75,23.88 31.75,26.92 38.1,19.05
  pour Top (no thermals): 14.48,6.86 14.48,4.32 19.56,4.32 19.56,6.86
  pour Top (no thermals): 14.48,11.94 14.48,14.48 19.56,14.48 19.56,11.94
  pour Top (no thermals): 14.48,22.1 14.48,19.56 19.56,19.56 19.56,22.1
  pour Top (no thermals): 15.24,29.72 15.24,27.18 19.56,27.18 20.32,29.72
  pour Top (no thermals): 15.24,37.34 15.24,34.8 20.32,34.8 20.32,37.34
  pour Top (no thermals): 24.13,41.4 20.83,41.4 20.83,36.58 24.13,36.58
  pour Top (no thermals): 5.59,6.6 5.59,10.16 7.87,10.16 7.87,6.6
  pour Top (no thermals): 3.3,16 3.3,21.08 6.35,21.08 6.35,18.54 5.84,18.54 5.84,16
  pour Top (no thermals): 5.59,29.46 5.59,32.77 7.87,33.53 7.87,29.46
  pour Top (no thermals): 3.3,38.86 3.3,43.94 6.35,43.94 6.35,41.4 5.84,41.4 5.84,38.86
  pour Bottom (isolate 0.305): 0,50.04 97.79,50.55 97.79,-1.27 0,0
  pour Top (isolate 0.406, rank 3): -1.02,51.31 97.79,51.31 97.79,-1.27 -1.02,-1.27
HS
  Top 0.203: IC4.46 68.88,41.7 70.61,43.43 81.79,43.43 82.04,43.18 U$5.A1
INT1
  Top 0.203: IC4.55 62.24,32.25 60.71,33.78 60.71,43.18 61.98,44.45 63.75,44.45 U$7.6
LLC
  Top 0.203: IC4.25 75.69,31.75 75.69,31.24 75.69,27.43 77.22,25.91 77.22,20.32 87.38,10.16 U$5.A14
LRCLK  (via drill 0.5)
  Top 0.203: IC4.50 64.31,34.75 63.25,35.81 63.25,39.88 v64.01,40.64
  Bottom 0.203: U$7.2 73.41,43.94 68.07,43.94 64.77,40.64 v64.01,40.64
MCLK
  Top 0.203: U$7.3 71.37,44.45 69.85,44.45 67.31,41.91 63.25,41.91 62.48,41.15 62.48,35.81 64.05,34.25 IC4.51
N$1
  Top 0.203: IC4.13 73.91,25.76 73.91,21.84 74.12,21.64 IC5.P$4 IC5.P$35 74.09,14.29 J1.P$1
N$2
  Top 0.203: IC4.12 73.41,25.77 73.41,21.84 73.12,21.56 IC5.P$6 IC5.P$33 73.09,14.29 J1.P$3
N$3
  Top 0.203: IC5.P$7 72.62,21.61 72.39,21.84 72.39,25.78 IC4.10 | 72.59,21.49 IC5.P$7 | J1.P$4 72.59,14.29 IC5.P$32 IC5.P$7
N$4
  Top 0.203: IC4.9 71.88,21.84 71.62,21.58 IC5.P$9 IC5.P$30 71.59,14.29 J1.P$6
N$5
  Top 0.203: IC4.7 70.87,25.78 70.87,21.84 71.12,21.59 IC5.P$10 IC5.P$29 71.12,8.6 J1.P$7
N$6
  Top 0.203: IC4.6 70.36,25.78 70.36,21.84 70.12,21.61 IC5.P$12 IC5.P$27 70.09,14.29 J1.P$9
N$7
  Top 0.203: IC4.4 69.34,25.76 69.34,21.84 69.62,21.57 IC5.P$13 IC5.P$26 69.62,8.6 J1.P$10
N$8
  Top 0.203: IC4.3 68.83,25.75 68.83,21.84 68.62,21.63 IC5.P$15 IC5.P$24 68.59,14.29 J1.P$12
N$9
  Top 0.203: U$8.7 39.62,41.15 38.1,39.62 38.1,24.89 42.29,20.7 IC3.9
N$10
  Top 0.203: U$8.6 42.16,42.93 38.61,39.37 38.61,25.15 43.56,20.19 IC3.8
N$11
  Top 0.203: U$8.5 44.7,44.7 39.12,39.12 39.12,25.4 44.7,19.81 44.7,18.62 IC3.7
N$12
  Top 0.203: U$8.4 45.97,44.45 45.21,44.45 39.62,38.86 39.62,25.65 44.96,20.32 45.72,20.32 45.97,20.07 45.97,18.62 IC3.6
N$13
  Top 0.203: J1.P$13 68.09,14.29 IC5.P$23 68.12,15.7 67.82,16 66.04,16 65.79,15.75 65.79,13.97 65.53,13.72 R1.1
N$14
  Top 0.203: IC5.P$22 67.62,10.72 67.06,10.16 67.06,8.61 J1.P$15 67.09,6.57 67.82,5.84 79.92,5.84 R2.1
N$15
  Top 0.203: IC5.P$21 67.12,10.99 66.55,10.41 66.55,8.61 J1.P$16 66.55,8.53 66.55,5.84 67.82,4.57 79.92,4.57 R3.1
N$16
  Top 0.203: IC5.P$20 66.62,11.25 65.53,10.16 | 65.53,10.16 65.02,9.65 | 65.02,9.65 65.02,8.64 J1.P$19 | 65.02,10.67 65.02,11.18 64.43,11.77 R6.2 62.9,11.68 61.72,11.68 61.47,11.94 61.47,14.99 61.22,15.23 Q2.P$3 | 65.02,10.67 65.02,10.41 | 65.02,9.91 65.02,9.65 | 65.02,10.67 65.53,10.16 | 65.53,10.16 65.28,10.16 | 65.28,10.16 65.02,10.41 | 65.02,10.41 65.02,9.91 | 65.02,9.91 65.28,10.16
N$17
  Top 0.203: U$8.3 48.01,43.94 45.47,43.94 40.13,38.61 40.13,25.91 45.21,20.83 46.74,20.83 47.24,20.32 47.24,18.62 IC3.5
N$18
  Top 0.203: U$8.2 50.04,43.43 45.72,43.43 40.64,38.35 40.64,26.16 45.47,21.34 46.99,21.34 48.51,19.81 48.51,18.62 IC3.4
N$19
  Top 0.813: R12.2 LED2.A
N$20
  Top 0.203: R8.1 66.29,25.65 66.55,25.4 66.55,24.38 67.62,23.31 IC5.P$17 67.56,20.17 67.56,18.54 67.06,18.03 55.88,18.03 55.37,18.54 55.37,27.94 56.13,28.7 65.88,28.7 IC4.62
N$21
  Top 0.813: IC2.2 4.72,14.73 | 10.92,14.83 IC2.4
  pour Top (no thermals): 3.81,13.97 6.35,13.97 6.35,11.68 9.65,11.68 9.65,7.87 12.19,5.33 13.97,5.33 13.97,6.6 12.45,6.6 12.45,12.95 13.97,12.95 13.97,14.22 12.45,14.22 12.45,20.57 13.97,20.57 13.97,21.84 8.38,21.84 7.37,20.83 7.37,18.8 6.35,17.78 6.35,15.49 3.81,15.49
N$22
  Top 0.813: IC1.4 11.02,36.49 | L2.1 9.02,42.42 C7.1
  pour Top (no thermals): 3.81,36.83 6.35,36.83 6.35,34.54 9.65,34.54 9.65,30.48 11.94,28.19 14.73,28.19 14.73,29.46 13.21,29.46 13.21,35.81 14.73,35.81 14.73,37.08 13.21,37.08 13.21,41.91 23.11,41.91 23.11,43.94 8.13,43.94 7.37,43.43 7.37,41.66 6.35,40.64 6.35,38.35 3.81,38.35
N$23
  Top 0.203: R7.1 66.55,23.62 67.06,23.11 67.06,21.59 IC5.P$18 67.12,18.86 66.8,18.54 56.13,18.54 55.88,18.8 55.88,27.69 56.39,28.19 65.88,28.19 IC4.63
N$24
  Top 0.203: 64.52,17.53 67.31,17.53 68.07,18.29 68.07,20.17 IC5.P$16 | 64.52,17.53 55.63,17.53 54.86,18.29 54.86,28.19 55.88,29.21 65.89,29.21 IC4.61 | R9.1 64.6,17.44 64.52,17.53
N$25
  Top 0.203: IC4.59 60.73,30.25 60.2,29.72 53.43,29.72 R10.1 C2.2 49.87,26.25 X1.1
N$26
  Top 0.203: IC4.58 60.69,30.75 60.2,31.24 53.43,31.24 R10.2 C3.2 49.87,34.71 X1.2
N$34
  Top 0.203: IC5.P$37 75.12,11.75 75.69,11.18 C1.1
N$35
  Top 0.203: U$8.1 54.61,45.72 51.82,42.93 45.97,42.93 41.15,38.1 41.15,26.42 45.72,21.84 47.24,21.84 48.77,20.32 49.53,20.32 49.78,20.07 49.78,18.62 IC3.3
N$36
  Top 0.203: U$8.0 57.4,44.45 55.37,42.42 46.23,42.42 41.66,37.85 41.66,26.67 45.97,22.35 47.5,22.35 49.02,20.83 50.29,20.83 51.05,20.07 51.05,18.62 IC3.2
N$37
  Top 0.203: SV1.2 38.61,6.6 40.44,8.43 IC3.11
N$39
  Top 0.203: SV1.4 42.29,5.71 IC3.12
N$40
  Top 0.203: SV1.6 43.56,4.7 IC3.13
N$41
  Top 0.203: SV1.10 46.1,7.24 IC3.15
N$42
  Top 0.203: SV1.12 51.05,4.57 49.53,6.1 48.26,6.1 47.5,6.86 47.5,8.31 IC3.16
N$44
  Top 0.203: SV1.14 52.07,6.35 50.04,6.35 49.78,6.6 49.28,6.6 48.77,7.11 48.77,8.31 IC3.17
N$45
  Top 0.203: SV1.16 56.39,5.33 54.86,6.86 50.29,6.86 50.04,7.11 50.04,8.31 IC3.18
N$46
  Top 0.203: SV1.8 44.83,5.97 IC3.14
N$47  (via drill 0.5)
  Top 0.203: IC5.P$2 75.18,20.22 75.18,17.53 v75.44,17.27
  Bottom 0.813: R16.2 v75.44,17.27 C19.1
N$52
  Top 0.203: Q2.P$5 Q2.P$6 57.47,12.89 58.67,11.68 59.86,11.68 R5.1
N$53  (via drill 0.5)
  Top 0.203: 58.25,10.07 v58.17,10.16
  Top 0.305: IC4.64 57.46,27.75 v56.64,26.92 | J1.P$18 65.59,7.17 65.02,6.6 64.52,6.6 64.01,7.11 64.01,9.06 R6.1 R5.2 58.25,10.07
  Bottom 0.813: v56.64,26.92 55.12,26.92 54.61,26.42 54.61,13.46 57.4,10.16 v58.17,10.16
N$55
  Top 0.305: R4.1 60.79,21.5 60.2,22.1 57.18,22.1 LED1.A
N$56
  Top 0.203: 59.62,24.12 Q3.3
  Top 0.305: 59.62,24.12 57.15,24.12 LED1.C
N$57
  Top 0.203: IC5.P$19 66.62,20.39 66.29,20.07 62.74,20.07 62.23,20.57 62.23,25.65 | 62.23,25.65 62.23,25.91 | 62.23,25.91 62.23,26.16 | IC4.1 67.74,25.65 67.31,25.65 66.29,26.67 62.48,26.67 62.23,26.42 62.23,26.16 | 62.23,25.91 62.15,25.99 62.06,25.91 60.98,25.91 Q3.1 | 62.23,26.16 61.98,25.91 62.23,25.65
NRESET
  Top 0.203: IC4.56 61.73,31.75 60.2,33.27 60.2,43.43 U$7.7 62.48,48.09 R15.1
P0
  Top 0.203: IC4.43 70.38,39.64 73.15,42.42 81.28,42.42 83.06,40.64 U$5.A2
P1
  Top 0.203: IC4.42 70.88,39.38 73.41,41.91 81.03,41.91 83.57,39.37 89.15,39.37 U$5.B3
P2
  Top 0.203: IC4.41 71.38,39.12 73.66,41.4 80.77,41.4 84.07,38.1 U$5.A3
P3
  Top 0.203: IC4.39 72.38,39.36 73.91,40.89 80.52,40.89 84.58,36.83 89.15,36.83 U$5.B4
P4
  Top 0.203: IC4.38 72.88,39.1 74.17,40.39 80.26,40.39 85.09,35.56 U$5.A4
P5
  Top 0.203: IC4.37 73.38,38.83 74.42,39.88 80.01,39.88 85.6,34.29 89.15,34.29 U$5.B5
P6
  Top 0.203: IC4.36 73.88,38.57 74.68,39.37 79.76,39.37 86.11,33.02 U$5.A5
P7
  Top 0.203: IC4.35 74.38,38.31 74.93,38.86 79.5,38.86 86.61,31.75 89.15,31.75 U$5.B6
P8
  Top 0.203: U$5.A6 87.12,30.48 81.79,35.81 79.76,35.81 78.37,37.2 IC4.33
P9
  Top 0.203: IC4.32 81.59,35.25 84.84,32 84.84,30.23 85.85,29.21 89.15,29.21 U$5.B7
P10
  Top 0.203: IC4.31 81.33,34.75 84.33,31.75 84.33,28.7 85.09,27.94 U$5.A7
P11
  Top 0.203: IC4.30 81.07,34.25 83.82,31.5 83.82,27.69 84.84,26.67 89.15,26.67 U$5.B8
P12
  Top 0.203: IC4.29 80.81,33.75 83.31,31.24 83.31,25.91 83.82,25.4 U$5.A8
P13
  Top 0.203: IC4.28 80.55,33.25 82.8,30.99 82.8,24.89 83.57,24.13 89.15,24.13 U$5.B9
P14
  Top 0.203: IC4.27 80.28,32.75 82.3,30.73 82.3,23.37 82.8,22.86 U$5.A9
P15
  Top 0.203: IC4.26 80.02,32.25 81.79,30.48 81.79,22.35 82.55,21.59 89.15,21.59 U$5.B10
P16
  Top 0.203: IC4.22 79.23,30.25 80.77,28.7 80.77,21.84 82.3,20.32 U$5.A10
P17
  Top 0.203: IC4.21 78.97,29.75 80.26,28.45 80.26,21.59 82.8,19.05 89.15,19.05 U$5.B11
P18
  Top 0.203: IC4.20 78.7,29.25 79.76,28.19 79.76,21.34 83.31,17.78 U$5.A11
P19
  Top 0.203: IC4.19 78.44,28.75 79.25,27.94 79.25,21.08 83.82,16.51 89.15,16.51 U$5.B12
P20
  Top 0.203: IC4.18 78.18,28.25 78.74,27.69 78.74,20.83 84.33,15.24 U$5.A12
P21
  Top 0.203: IC4.17 77.33,27.57 78.23,26.67 78.23,20.57 86.11,12.7 U$5.A13
P22
  Top 0.203: IC4.16 76.31,25.8 76.71,25.4 76.71,20.07 85.6,11.18 85.6,8.89 86.87,7.62 U$5.A15
P23
  Top 0.203: IC4.15 74.88,24.94 75.18,24.64 75.95,24.64 76.2,24.38 76.2,19.81 84.84,11.18 84.84,7.11 86.87,5.08 U$5.A16
PVDD_1V8  (via drill 0.5)
  Top 0.305: IC4.57 61.21,31.25 60.2,32.26 55.37,32.26 v54.86,32.77
  Top 0.813: 16.76,40.64 C11.+
  Bottom 0.813: C16.1 v54.86,32.77 53.85,33.78 24.38,33.78 22.86,35.05 22.86,40.13 22.1,40.89 v15.24,40.89
  other vias: 16.51,40.89 17.78,40.89 19.05,40.89
  pour Top (no thermals): 13.72,38.1 19.81,38.1 19.81,41.4 13.72,41.4
SCL
  Top 0.203: IC4.53 65.9,33.27 62.74,33.27 61.72,34.29 61.72,42.67 62.48,43.43 68.07,43.43 70.1,45.47 U$7.4 70.1,48.09 R13.1
SCLK  (via drill 0.5)
  Top 0.203: IC4.49 65.87,35.31 64.52,35.31 64.01,35.81 64.01,38.86 v64.77,39.62
  Bottom 0.203: U$7.1 75.44,43.43 68.33,43.43 64.77,39.88 v64.77,39.62
SDA
  Top 0.203: IC4.54 62.5,32.75 61.21,34.04 61.21,42.93 62.23,43.94 65.79,43.94 U$7.5 67.56,46.74 67.06,47.24 64.52,47.24 64.26,47.5 64.26,48.43 R14.1
TVDD_3V3  (via drill 0.5)
  Top 0.203: 72.9,25.82 IC4.11 | v71.38,27.43 v71.37,27.43
  Top 0.305: IC4.5 69.88,27.4 v69.85,27.43 | v72.9,27.43 72.9,25.82 | IC4.8 v71.38,27.43
  Top 0.813: v35.81,36.32 v35.81,17.78
  Bottom 0.203: 73.51,27.43 C36.1 | 69.23,27.43 C18.1
  Bottom 0.61: v71.38,27.43 v72.9,27.43 | v71.38,27.43 v71.37,27.42 | 69.23,27.43 v71.38,27.43 | C25.1 71.38,29.06 v71.38,27.43 | 73.51,27.43 v72.9,27.43 | v72.9,27.43 | v69.85,27.43 69.23,27.43 C18.1
  Bottom 0.813: v71.37,27.42 71.37,26.67 70.61,25.91 61.98,25.91 60.2,27.69 60.2,31.5 55.37,36.32 v35.81,36.32 | v35.81,17.78 v14.73,17.78
  other vias: 16,17.78 17.27,17.78 18.54,17.78
  pour Top (no thermals): 12.95,15.24 12.95,18.54 19.05,18.54 19.05,15.24
VCC_3V3  (via drill 0.5)
  Top 0.203: Q2.P$2 58.42,14.73 58.17,14.99 v58.17,16 | 62.48,16 62.74,15.75 R9.2
  Top 0.406: R1.2 R9.2 | R4.2 v57.91,20.32 | 63.41,22.26 v63.5,22.1 | v58.17,16 62.48,16
  Top 0.813: R8.2 R7.2 63.41,22.26 | v58.17,16 57.91,16.26 55.37,16.26 53.34,14.22 v52.07,14.22
  Bottom 0.813: R16.1 67.22,22.1 v63.5,22.1 59.69,22.1 v57.91,20.32 58.17,20.07 v58.17,16 | v52.07,14.22 37.34,14.22 33.27,10.16 v14.73,10.16
  other vias: 16,10.16 17.27,10.16 18.54,10.16
  pour Top (no thermals): 12.95,7.62 19.05,7.62 19.05,10.67 12.95,10.67
VCC_5V0  (via drill 0.5, 0.5 pad 1.02, 0.6)
  Top 0.203: IC5.P$1 75.62,19.12 82.8,11.94 v82.8,11.18 | R2.2 82.04,6.26 82.04,5.33 | 82.04,5.33 82.04,5.08 | 82.04,5.08 82.04,4.83 | 82.04,4.83 82.04,4.15 R3.2 | v83.57,5.08 82.3,5.08 | 82.3,5.08 82.04,5.08 | 82.04,5.33 82.3,5.08 | 82.3,5.08 82.04,4.83
  Top 0.61: IC3.20 54.66,8.43 v55.12,8.89
  Top 0.813: F1.2 88.01,2.54 v86.87,2.54
  Top 1.27: 4.06,3.3 4.06,8.38 C6.1 1.52,8.38 1.52,12.19 | 1.52,12.19 1.52,31.24 | 1.52,31.24 C5.1 | IC2.3 4.72,12.19 1.52,12.19 | IC1.3 4.72,35.05 1.52,35.05 | 1.52,35.05 1.52,31.24 | 1.52,35.05 1.78,48.51
  Bottom 0.61: C26.1 v82.8,11.18
  Bottom 0.813: 85.6,5.08 85.6,4.06 86.87,2.79 v86.87,2.54 85.6,1.02 59.18,1.02 58.67,1.52 58.67,6.35 56.13,8.89 v55.12,8.89 | 85.6,5.08 85.6,11.18 v82.8,11.18 | 85.6,5.08 v83.57,5.08 | v12.95,1.52 v14.22,1.52 | 14.48,1.52 v15.49,1.52 v16.76,1.52 v18.03,1.52 34.29,1.52 36.07,3.3 36.07,6.86 38.1,8.89 v55.12,8.89 | 47.62,8.94 47.68,8.89 v55.12,8.89 | C21.1 55.12,9.74 v55.12,8.89
  pour Top (no thermals): 19.05,0 0.25,0 0.25,35.81 5.59,35.81 5.59,33.53 4.83,32.77 4.83,28.96 2.79,27.18 2.79,13.72 3.56,12.95 5.59,12.95 5.59,10.92 4.83,10.16 4.83,5.59 6.1,4.32 6.1,2.54 19.05,2.54
  pour Top (no thermals): 2.79,35.81 2.79,50.29 0.25,50.29 0.25,35.81
  pour Top (no thermals): 2.54,50.04 7.37,50.04 7.37,45.21 3.56,45.21 2.54,44.2
VS
  Top 0.203: IC4.47 68.38,42.22 70.1,43.94 81.79,43.94 82.3,44.45 89.15,44.45 U$5.B1

### Text on the board
tPlace: 5V0 | 3V3 | 2V5 | GND | 1 | 2 | 3 | 4 | 5 | 6 | 7 | 8 | OSHW | 1 | 2 | 3 | 4 | 5 | 6 | 7 | 8
tNames: GND | MISO | D10 | D8 | + | - | nRST | SDA | MCLK | SCLK | AP | AREF | SCK | MOSI | D9 | INT1 | SCL | LRCLK | + | HS | VS | P0 | DE | + | Papilio HDMI Receiver | + | P2 | Papilio Duo port by | P4 | 1V8 | Steven Cooreman | + | P6 | Added ZigBee module | P8 | P10 | + | P12 | based on v1.1 Dec 2014 | http://hacks.esar.org.uk/ | P14 | + | Hotplug | P16 | MOSI | SCK | + | D10 | MISO | SS | P18 | P20 | P21 | 3V3 | + | LCC | P22 | + | P23 | VCC_5V0 | -
bNames: PVDD_1V8 | CVDD_1V8 | DVDD_1V8 | DVDDIO_3V3 | TVDD_3V3 | VCC_3V3